# EAGLE design samd1 (EAGLE 6.3)
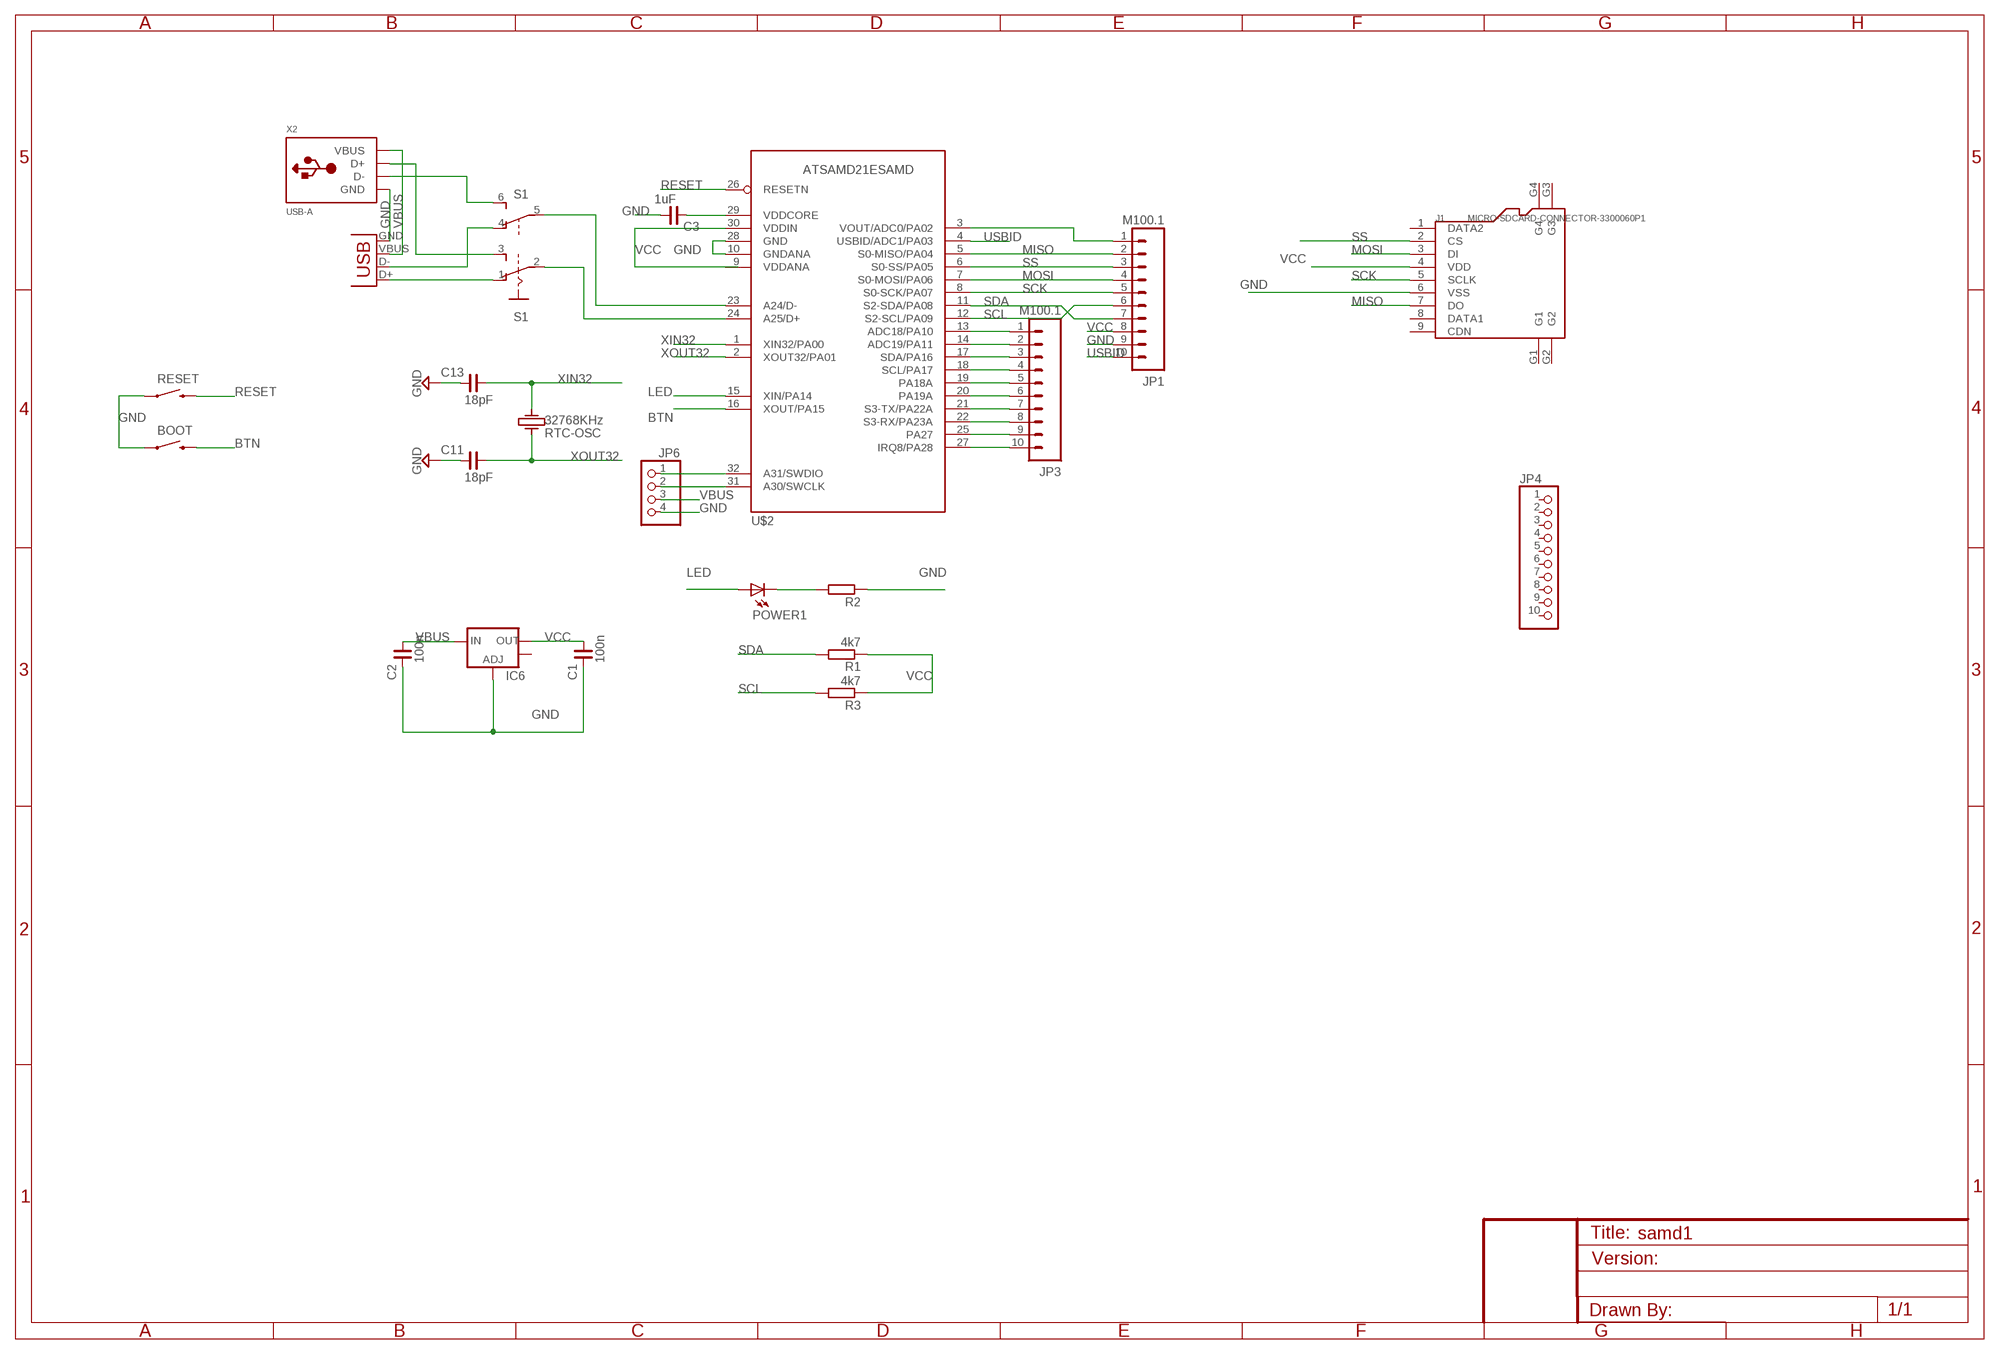
[diagram p0: schematic, sheet 1]

## Parts
BOOT  SWITCH-MOMENTARY-2-SMD-1101NE  [TACTILE-SWITCH-1101NE]
C1  100n  C_0603  [C0603]
C2  100n  C_0603  [C0603]
C3  1uF  C_0603  [C0603]
C11  18pF  C_0603  [C0603]
C13  18pF  C_0603  [C0603]
IC6  V_REG_LM1117SOT223  [SOT223]
J1  MICRO-SDCARD-CONNECTOR-3300060P1  [9P-SMD-W-RING]
JP1  M100.1  [1X10]
JP3  M100.1  [1X10]
JP4  PINHD-1X10  [1X10]
JP6  PINHD-1X4/90  [1X04/90]
POWER1  Power  LED0603  [LED-0603]
R1  4k7  R-EU_R0603  [R0603]
R2  R-EU_R0603  [R0603]
R3  4k7  R-EU_R0603  [R0603]
RESET  SWITCH-MOMENTARY-2-SMD-1101NE  [TACTILE-SWITCH-1101NE]
RTC-OSC  32768KHz  CRYSTALL  [KX-327LT]
S1  A68-A31  [A68-A31]
U$2  ATSAMD21ESAMD  [TQFP32-08]
X2  USB-A  [MOLEX_480371000]
X3  USB_  [USB-A-S-SILK-FEMALE]

## Nets
BTN: BOOT.P$2 U$2.16(XOUT/PA15)
GND [vcc]: BOOT.P$1 C1.2 C2.2 C3.1 C11.2 C13.2 IC6.1(ADJ) J1.6(VSS) JP1.9 JP6.4 R2.1 RESET.P$1 U$2.10(GNDANA) U$2.28(GND) X2.4(GND) X3.GND
LED: POWER1.A U$2.15(XIN/PA14)
MISO: J1.7(DO) JP1.2 U$2.5(S0-MISO/PA04)
MOSI: J1.3(DI) JP1.4 U$2.7(S0-MOSI/PA06)
N$1: JP1.1 U$2.3(VOUT/ADC0/PA02)
N$2: S1.2(A:P) U$2.24(A25/D+)
N$3: C3.2 U$2.29(VDDCORE)
N$5: POWER1.C R2.2
N$10: JP3.1 U$2.13(ADC18/PA10)
N$11: JP3.2 U$2.14(ADC19/PA11)
N$12: JP3.3 U$2.17(SDA/PA16)
N$13: JP3.4 U$2.18(SCL/PA17)
N$14: JP3.5 U$2.19(PA18A)
N$15: JP3.6 U$2.20(PA19A)
N$16: JP3.7 U$2.21(S3-TX/PA22A)
N$17: JP3.8 U$2.22(S3-RX/PA23A)
N$18: JP3.9 U$2.25(PA27)
N$19: JP3.10 U$2.27(IRQ8/PA28)
N$21: S1.5(B:P) U$2.23(A24/D-)
N$22: S1.6(B:S) X2.2(D-)
N$23: S1.4(B:O) X3.D-
N$24: S1.3(A:S) X2.3(D+)
N$25: S1.1(A:O) X3.D+
N$28: JP6.2 U$2.31(A30/SWCLK)
N$29: JP6.1 U$2.32(A31/SWDIO)
RESET: RESET.P$2 U$2.26(RESETN)
SCK: J1.5(SCLK) JP1.5 U$2.8(S0-SCK/PA07)
SCL: JP1.6 R3.2 U$2.12(S2-SCL/PA09)
SDA: JP1.7 R1.2 U$2.11(S2-SDA/PA08)
SS: J1.2(CS) JP1.3 U$2.6(S0-SS/PA05)
USBID: JP1.10 U$2.4(USBID/ADC1/PA03)
VBUS: C2.1 IC6.3(IN) JP6.3 X2.1(VBUS) X3.VBUS
VCC [vcc]: C1.1 IC6.2(OUT) J1.4(VDD) JP1.8 R1.1 R3.1 U$2.30(VDDIN)
XIN32: C13.1 RTC-OSC.1 U$2.1(XIN32/PA00)
XOUT32: C11.1 RTC-OSC.4 U$2.2(XOUT32/PA01)
Unconnected: IC6.4(OUT) J1.1(DATA2) J1.8(DATA1) J1.9(CDN) J1.G1 J1.G2 J1.G3 J1.G4 JP4.1 JP4.2 JP4.3 JP4.4 JP4.5 JP4.6 JP4.7 JP4.8 JP4.9 JP4.10 U$2.9(VDDANA)

## Library data of the parts
BOOT RESET = SparkFun:SWITCH-MOMENTARY-2
C1-C3 C11 C13 = rc-master-smd:C_: NON-POLARIZED CAP
IC6 = SparkFun:V_REG_LM1117: Voltage Regulator LM1117 Standard adjustable voltage regulator but in SMD form. Spark Fun Electronics SKU : COM-00595
J1 = OPL5:MICRO-SDCARD-CONNECTOR: Micro SD Card
JP1 JP3 = SparkFun:M10: Header 10 Standard 10-pin 0.1" header. Use with straight break away headers (SKU : PRT-00116), right angle break away headers (PRT-00553), swiss pins (PRT-00743), machine pins (PRT-00117), and female headers (PRT-00115).
JP4 = pinhead:PINHD-1X10: PIN HEADER
JP6 = pinhead:PINHD-1X4: PIN HEADER
POWER1 = SparkFun:LED: LEDs Standard schematic elements and footprints for 5mm, 3mm, 1206, and 0603 sized LEDs. 5mm - Spark Fun Electronics SKU : COM-00529 (and others)
R1-R3 = resistor:R-EU_: RESISTOR, European symbol
RTC-OSC = es:CRYSTALL
S1 = switch:A68-A31: SLIDING SWITCH Siemens, distributor Buerklin, 11G766
U$2 = atsamd21E:ATSAMD21E
X2 = adafruit:USB-A: USB type A 'plug' Used for things that can directly connect to a USB port, say USB key
X3 = SparkFun:USB: USB Connectors USB-B-PTH is fully proven SKU : PRT-00139 USB-miniB is fully proven SKU : PRT-00587 USB-A-PCB is untested. USB-A-H is throughly reviewed, but untested. Spark Fun Electronics SKU : PRT-00437 USB-B-SMT is throughly reviewed, but untested. Needs silkscreen touching up. USB-A-S has not been used/tested USB-MB-H has not been used/tested

## Net classes
0 default: width 0.254 mm, drill 0.381 mm, clearance 0.254 mm
1 vcc: width 0.254 mm, drill 0.381 mm, clearance 0.254 mm
2 pwr: width 0.254 mm, drill 0.381 mm, clearance 0.254 mm

## Board
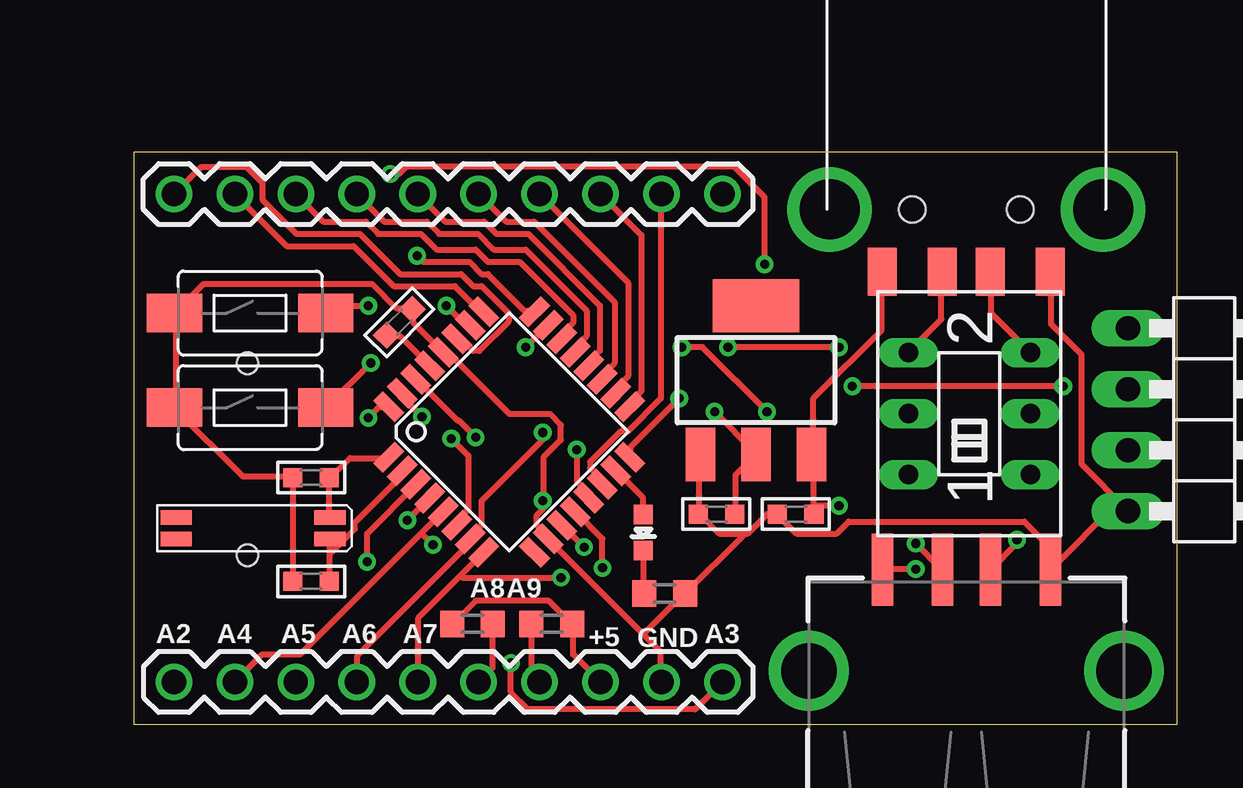
[diagram p1: board, top side]
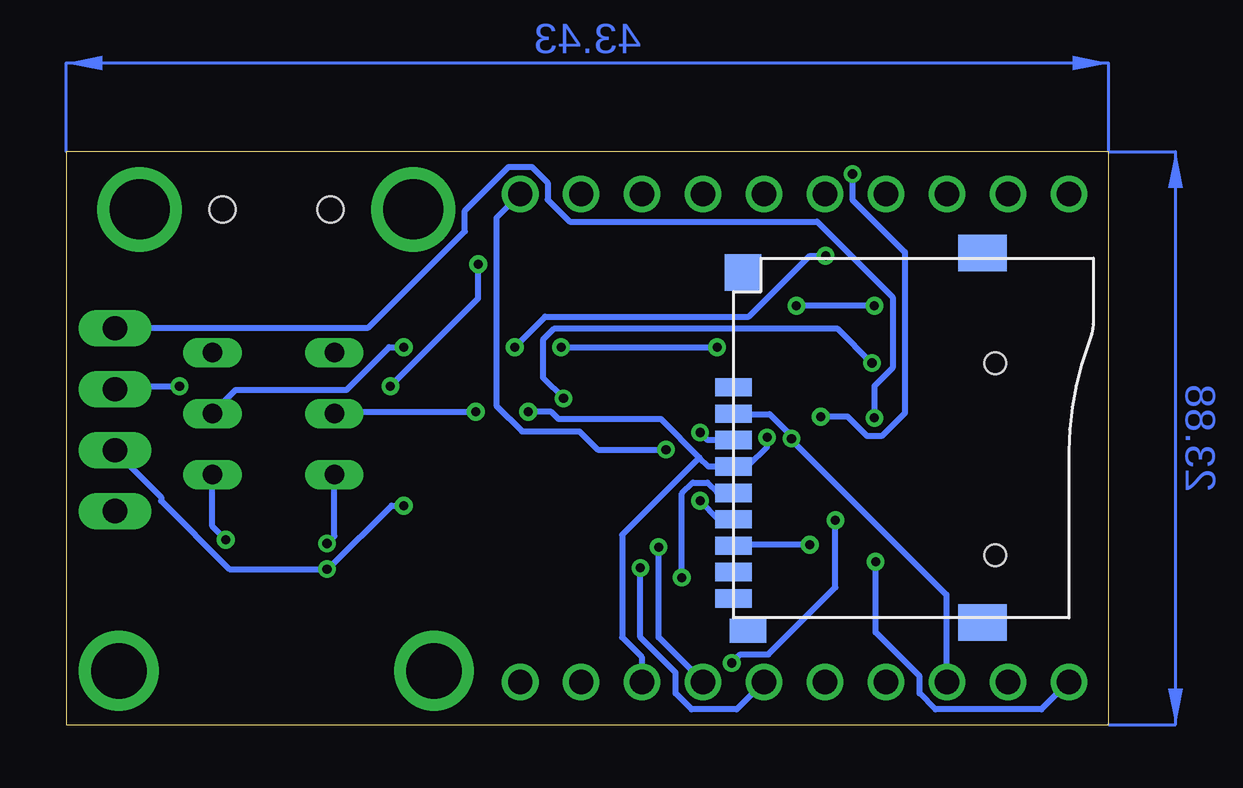
[diagram p2: board, bottom side, seen from below]

Size 43.43 x 23.88 mm. Coordinates in mm from the lower left corner, seen from the top.
Outline: 0,23.88 43.43,23.88 43.43,0 0,0 0,23.88
Copper layers (1*16): Top 0.0356mm / dielectric 1.5011mm / Bottom 0.0356mm
Design rules "LaenPCBOrder *": minimum track width 6mil, minimum drill 13mil, track to track 6mil, track to pad 6mil, pad to pad 6mil, via to via 6mil, smd to smd 6mil, copper to edge 15mil, drill to drill 6mil, minimum pad ring 7mil, minimum via ring 7mil, stop-mask expansion 3mil, vias tented up to drill 100mil, thermal gap 10mil

### Footprints (pad centres in the part's own frame; a part is rotated, then mirrored left to right if it is on the bottom)
TACTILE-SWITCH-1101NE = smd 2.3 x 1.6: P$1 -3.15,0; P$2 3.15,0
C0603 = smd 0.8 x 0.8: 1 -0.762,0; 2 0.762,0
SOT223 = smd 1.219 x 2.235: 1 -2.311,-3.099; 2 0,-3.099; 3 2.311,-3.099 | smd 3.6 x 2.2: 4 0,3.099
9P-SMD-W-RING = smd 1.524 x 0.762: 1 -7.493,2.114; 2 -7.493,1.014; 3 -7.493,-0.086; 4 -7.493,-1.186; 5 -7.493,-2.286; 6 -7.493,-3.386; 7 -7.493,-4.486; 8 -7.493,-5.586; 9 -7.493,-6.686 | smd 1.524 x 1.016: G1 -6.893,-8.032 | smd 2.032 x 1.524: G2 2.88,-7.686; G3 2.88,7.714 | smd 1.524 x 1.524: G4 -7.101,6.895 | hole 0.889: 3.407,-4.886; 3.407,3.114
1X10 = drill 1.016: 1 0,0; 2 2.54,0; 3 5.08,0; 4 7.62,0; 5 10.16,0; 6 12.7,0; 7 15.24,0; 8 17.78,0; 9 20.32,0; 10 22.86,0
1X10' = drill 1.016 long: 1 -11.43,0; 2 -8.89,0; 3 -6.35,0; 4 -3.81,0; 5 -1.27,0; 6 1.27,0; 7 3.81,0; 8 6.35,0; 9 8.89,0; 10 11.43,0
1X04/90 = drill 1.016 long: 1 -3.81,-3.81; 2 -1.27,-3.81; 3 1.27,-3.81; 4 3.81,-3.81
LED-0603 = smd 0.8 x 0.8: A 0,-0.75; C 0,0.75
R0603 = smd 1 x 1.1: 1 -0.85,0; 2 0.85,0
KX-327LT = smd 1.3 x 0.6: 1 -3.2,-0.5; 2 3.2,-0.5; 3 3.2,0.4; 4 -3.2,0.4
A68-A31 = drill 0.813 long: 1 -2.54,-2.54; 2 0,-2.54; 3 2.54,-2.54; 4 -2.54,2.54; 5 0,2.54; 6 2.54,2.54
TQFP32-08 = smd 1.27 x 0.559: 1 -4.293,2.8; 2 -4.293,2; 3 -4.293,1.2; 4 -4.293,0.4; 5 -4.293,-0.4; 6 -4.293,-1.2; 7 -4.293,-2; 8 -4.293,-2.8; 17 4.293,-2.8; 18 4.293,-2; 19 4.293,-1.2; 20 4.293,-0.4; 21 4.293,0.4; 22 4.293,1.2; 23 4.293,2; 24 4.293,2.8 | smd 0.559 x 1.27: 9 -2.8,-4.293; 10 -2,-4.293; 11 -1.2,-4.293; 12 -0.4,-4.293; 13 0.4,-4.293; 14 1.2,-4.293; 15 2,-4.293; 16 2.8,-4.293; 25 2.8,4.293; 26 2,4.293; 27 1.2,4.293; 28 0.4,4.293; 29 -0.4,4.293; 30 -1.2,4.293; 31 -2,4.293; 32 -2.8,4.293
MOLEX_480371000 = smd 1.2 x 2: 1 3.5,2.6; 2 1,2.6; 3 -1,2.6; 4 -3.5,2.6 | drill 2.5: M1 -5.7,0; M2 5.7,0 | hole 1.1: -2.25,0; 2.25,0
USB-A-S-SILK-FEMALE = smd 3 x 0.9: D+ 7.212,-1; D- 7.212,1; GND 7.212,-3.5; VBUS 7.212,3.5 | drill 2.311: P$5 3,-6.566; P$6 3,6.566

### Placement (x,y rotation side)
BOOT  4.83,13.21 0 top
C1  24.26,8.76 180 top
C2  27.56,8.76 180 top
C3  11.05,16.76 225 top
C11  7.37,5.97 180 top
C13  7.37,10.29 180 top
IC6  25.91,14.35 0 top
J1  8.13,11.94 0 bottom
JP1  1.65,1.78 0 top
JP3  24.51,22.1 180 top
JP4  [1X10']  57.53,11.81 90 top  (outside the outline)
JP6  45.21,12.7 270 top
POWER1  21.21,8 180 top
R1  17.4,4.19 180 top
R2  22.1,5.46 180 top
R3  14.1,4.19 0 top
RESET  4.83,17.15 0 top
RTC-OSC  4.95,8.13 180 top
S1  34.8,12.95 90 top
U$2  15.62,12.19 45 top
X2  34.67,21.46 180 top
X3  34.67,-0.76 90 top

### Tracks (layer width: path | path; a pad name or v marks a point on that pad's centre or on a via)
BTN  (via drill 0.38)
  Top 0.254: v22.71,13.59 20.68,11.56 20.68,11.15 U$2.16 | v9.86,15.06 8.03,13.23 BOOT.P$2
  Bottom 0.254: v22.71,13.59 23.57,14.45 23.57,16.03 23.11,16.48 11.28,16.48 v9.86,15.06
GND  (via drill 0.38)
  Top 0.254: C11.2 C13.2 6.5,10.34 4.52,10.34 1.68,13.18 BOOT.P$1 1.73,13.33 1.73,17.04 RESET.P$1 | RESET.P$1 2.9,18.36 9.91,18.36 10.92,17.35 11.48,17.35 C3.1 11.63,17.3 11.63,16.74 12.85,15.52 U$2.28 12.95,15.42 13.16,15.42 15.65,12.93 17.32,12.93 17.78,12.47 17.78,11.86 17.07,11.15 17.07,9.42 v17.02,9.32 17.02,8.97 16.76,8.71 16.76,8.31 17.22,7.85 U$2.10 17.27,7.7 21.21,3.76 | RESET.P$1 | X2.4 38.2,18.82 38.2,16.69 39.47,15.42 39.47,10.85 41.4,8.92 JP6.4 40.94,9.22 38.2,6.48 X3.GND 38.56,6.99 37.08,8.46 29.77,8.46 29.26,7.95 27.58,7.95 26.87,8.66 C2.2 26.36,8.76 25.55,7.95 25.35,7.95 | IC6.1 23.57,11.25 23.52,11.2 23.52,8.76 C1.2 23.62,8.71 24.38,7.95 25.35,7.95 | 25.35,7.95 25.35,7.85 22.96,5.46 R2.1 22.86,5.41 21.21,3.76 | 21.21,3.76 21.95,3.02 21.95,1.8 JP1.9
  Bottom 0.254: v17.02,9.32 16.26,8.56 15.65,8.56 J1.6
LED
  Top 0.254: POWER1.A 21.18,8.76 21.18,9.47 20.12,10.54 U$2.15
MISO  (via drill 0.38)
  Top 0.254: 11.96,7.98 6.91,2.92 5.33,2.92 JP1.2 | 11.96,7.98 12.85,8.87 U$2.5 | 11.96,7.98 v12.45,7.49
  Bottom 0.254: v12.45,7.49 15.6,7.49 J1.7
MOSI  (via drill 0.38)
  Top 0.254: JP1.4 9.3,1.8 9.3,2.87 13.97,7.54 13.97,7.7 U$2.7 14.02,7.85 14.48,8.31 14.48,9.32 17.02,11.86 v17.02,12.17
  Bottom 0.254: v17.02,12.17 16.71,11.86 15.65,11.86 J1.3
N$1  (via drill 0.38)
  Top 0.254: v9.7,6.78 9.7,7.95 11.74,9.98 U$2.3
  Bottom 0.254: v9.7,6.78 9.7,3.84 7.87,2.01 7.87,1.29 7.21,0.63 2.79,0.63 JP1.1
N$2  (via drill 0.38)
  Top 0.254: v11.79,19.53 12.04,19.28 13.97,19.28 14.48,18.77 14.73,18.77 16.26,17.25 16.66,17.25 U$2.24 | v29.36,15.72 v24.74,15.72
  Bottom 0.254: v11.79,19.53 12.45,19.53 14.99,16.99 23.47,16.99 v24.74,15.72 | v29.36,15.72 29.97,15.72 31.75,13.95 36.37,13.95 37.34,12.98 S1.2
N$3
  Top 0.254: C3.2 10.52,16.18 11.07,16.18 12.29,14.96 U$2.29
N$5
  Top 0.254: POWER1.C 21.23,7.24 21.23,5.46 R2.2
N$10  (via drill 0.38)
  Top 0.254: v18.44,11.46 18.44,10.13 18.9,9.68 18.9,9.47 U$2.13
  Bottom 0.254: v18.44,11.46 21.29,11.46 22.05,12.22 24.43,12.22 25.5,13.28 25.5,21.11 JP3.1
N$11
  Top 0.254: U$2.14 19.46,10.03 19.46,10.24 19,10.69 19,10.95 20.27,12.22 20.57,12.22 21.95,13.59 21.95,22.07 JP3.2
N$12
  Top 0.254: JP3.3 21.13,20.4 21.13,13.89 20.68,13.44 20.68,13.28 U$2.17
N$13
  Top 0.254: JP3.4 20.57,18.41 20.57,14.5 20.12,14.05 20.12,13.84 U$2.18
N$14
  Top 0.254: JP3.5 15.49,20.96 16.66,20.96 20.01,17.6 20.01,15.06 19.51,14.55 19.51,14.4 U$2.19
N$15
  Top 0.254: JP3.6 12.95,20.96 14.58,20.96 15.09,20.45 16.41,20.45 19.41,17.45 19.41,15.57 18.95,15.11 18.95,14.96 U$2.20
N$16
  Top 0.254: JP3.7 10.41,20.96 12.19,20.96 12.7,20.45 14.33,20.45 14.99,19.79 16.31,19.79 18.85,17.25 18.85,16.18 18.39,15.72 18.39,15.52 U$2.21
N$17
  Top 0.254: JP3.8 7.87,20.96 9.65,20.96 10.16,20.45 11.94,20.45 12.6,19.79 14.22,19.79 14.73,19.28 16.05,19.28 18.29,17.04 18.29,16.74 17.83,16.28 17.83,16.08 U$2.22
N$18
  Top 0.254: JP3.9 6.35,19.94 9.14,19.94 10.82,18.26 13.36,18.26 14.38,17.25 14.53,17.25 U$2.25
N$19
  Top 0.254: JP3.10 2.79,23.24 4.67,23.24 5.33,22.58 5.33,21.87 6.76,20.45 9.4,20.45 11.07,18.77 13.61,18.77 14.12,18.26 14.48,18.26 15.6,17.15 15.6,16.79 14.38,15.57 14.12,15.57 13.67,16.03 13.46,16.03 U$2.27
N$21  (via drill 0.38)
  Top 0.254: v16.31,15.72 17.22,16.64 U$2.23 | v22.81,15.72 23.67,15.72 v26.36,13.03
  Bottom 0.254: v22.81,15.72 v16.31,15.72 | v26.36,13.03 32.21,13.03 32.26,12.98 S1.5
N$22
  Top 0.254: X2.2 33.63,18.82 33.63,16.89 32.26,15.52 S1.6
N$23  (via drill 0.38)
  Top 0.254: v32.56,7.54 33.63,6.48 X3.D-
  Bottom 0.254: S1.4 32.26,7.85 v32.56,7.54
N$24
  Top 0.254: X2.3 35.71,18.82 35.71,17.15 37.34,15.52 S1.3
N$25  (via drill 0.38)
  Top 0.254: v36.78,7.7 36.78,7.54 35.71,6.48 X3.D+
  Bottom 0.254: S1.1 37.34,8.26 v36.78,7.7
N$28  (via drill 0.38)
  Top 0.254: v11.99,12.83 11.18,13.64 11.18,13.79 U$2.31 | v10.67,22.94 11.02,22.94 11.33,23.24 24.99,23.24 26.26,21.97 v26.26,19.18 | v38.71,14.1 v29.92,14.1
  Bottom 0.254: v11.99,12.83 10.87,12.83 10.06,12.01 9.45,12.01 8.48,12.98 8.48,19.69 10.67,21.87 v10.67,22.94 | v26.26,19.18 26.26,17.76 v29.92,14.1 | v38.71,14.1 41.3,14.1 41.4,13.99 JP6.2
N$29  (via drill 0.38)
  Top 0.254: v9.75,12.78 10.21,13.23 10.57,13.23 U$2.32
  Bottom 0.254: v9.75,12.78 9.75,14.1 8.99,14.86 8.99,17.8 12.14,20.96 22.45,20.96 23.37,21.87 23.37,22.58 24.03,23.24 24.99,23.24 26.82,21.41 26.82,20.55 30.84,16.54 41.4,16.54 JP6.1
RESET  (via drill 0.38)
  Top 0.254: v13,17.45 13.77,16.69 13.97,16.69 U$2.26 | v9.75,17.45 8.33,17.45 8.03,17.15 RESET.P$2
  Bottom 0.254: v9.75,17.45 v13,17.45
SCK  (via drill 0.38)
  Top 0.254: 13.59,6.2 11.84,4.45 11.84,1.8 JP1.5 | 13.59,6.2 14.53,7.14 U$2.8 | v17.78,6.12 13.67,6.12 13.59,6.2
  Bottom 0.254: v17.78,6.12 17.78,9.63 17.32,10.08 16.71,10.08 16.31,9.68 15.65,9.68 J1.5
SCL  (via drill 0.38)
  Top 0.254: JP1.6 14.93,2.36 14.93,4.19 R3.2 | v19.51,6.53 19.51,7.75 18.39,8.87 U$2.12
  Bottom 0.254: v19.51,6.53 19.51,3.63 18.03,2.16 18.03,1.29 17.37,0.63 15.49,0.63 JP1.6
SDA  (via drill 0.38)
  Top 0.254: JP1.7 16.56,2.11 16.56,4.19 R1.2 | v18.75,7.39 17.83,8.31 U$2.11
  Bottom 0.254: v18.75,7.39 18.75,3.63 JP1.7
SS  (via drill 0.38)
  Top 0.254: v13.21,11.91 13.92,11.2 13.92,8.97 13.46,8.51 13.46,8.36 U$2.6
  Bottom 0.254: J1.2 15.6,12.93 14.12,12.93 13.21,12.01 v13.21,11.91 13.16,11.81 6.76,5.41 6.76,1.8 JP1.3
USBID  (via drill 0.38)
  Top 0.254: v11.38,8.51 12.29,9.42 U$2.4 | v15.7,2.57 15.7,1.35 16.41,0.63 23.37,0.63 JP1.10
  Bottom 0.254: v11.38,8.51 11.38,5.72 14.17,2.92 15.34,2.92 v15.7,2.57
VBUS  (via drill 0.38)
  Top 0.254: X2.1 31.14,18.82 31.14,16.43 28.3,13.59 28.3,11.35 IC6.3 28.25,11.25 28.3,11.2 28.3,8.76 C2.1 28.4,9.12 v29.36,9.12 | v32.56,6.48 31.19,6.48 X3.VBUS
  Bottom 0.254: JP6.3 41.4,11.4 39.47,9.47 39.47,9.32 36.63,6.48 v32.56,6.48 32.46,6.53 29.87,9.12 v29.36,9.12
VCC  (via drill 0.38)
  Top 0.254: R3.1 14.22,5.16 17.27,5.16 18.24,4.19 R1.1 18.29,4.09 18.29,2.92 JP1.8 | C1.1 25.04,8.76 25.04,10.39 IC6.2 25.86,11.35 v24.18,13.03 | v14.22,11.96 13.51,12.67 13.46,12.67 11.79,14.35 U$2.30
  Bottom 0.254: v14.22,11.96 14.22,11.56 14.99,10.79 15.6,10.79 J1.4 15.75,10.74 16.66,10.74 17.04,11.13 | v24.18,13.03 23.22,13.03 22.91,12.72 18.64,12.72 17.04,11.13 | 17.04,11.13 20.27,7.9 20.27,3.63 19.46,2.82 19.46,1.8 JP1.8
XIN32
  Top 0.254: RTC-OSC.1 8.13,8.66 C13.1 8.23,10.34 8.99,11.1 10.57,11.1 U$2.1
XOUT32
  Top 0.254: 8.13,7.19 8.13,7.7 RTC-OSC.4 | 8.13,7.19 C11.1 | U$2.2 11.13,10.54 11.13,10.34 9.2,8.41 9.2,8.15 8.23,7.19 8.13,7.19
(copper drawn outside any net)
  shapes: Bottom area x2

### Text on the board
tNames: A8 | A9 | A2 | A4 | A5 | A6 | A7 | +5 | GND | A3